# Altium schematic sheet BLOCK DIAGRAM.SchDoc
size A3; DocumentNumber: 2; SheetNumber: 2; SheetTotal: 6
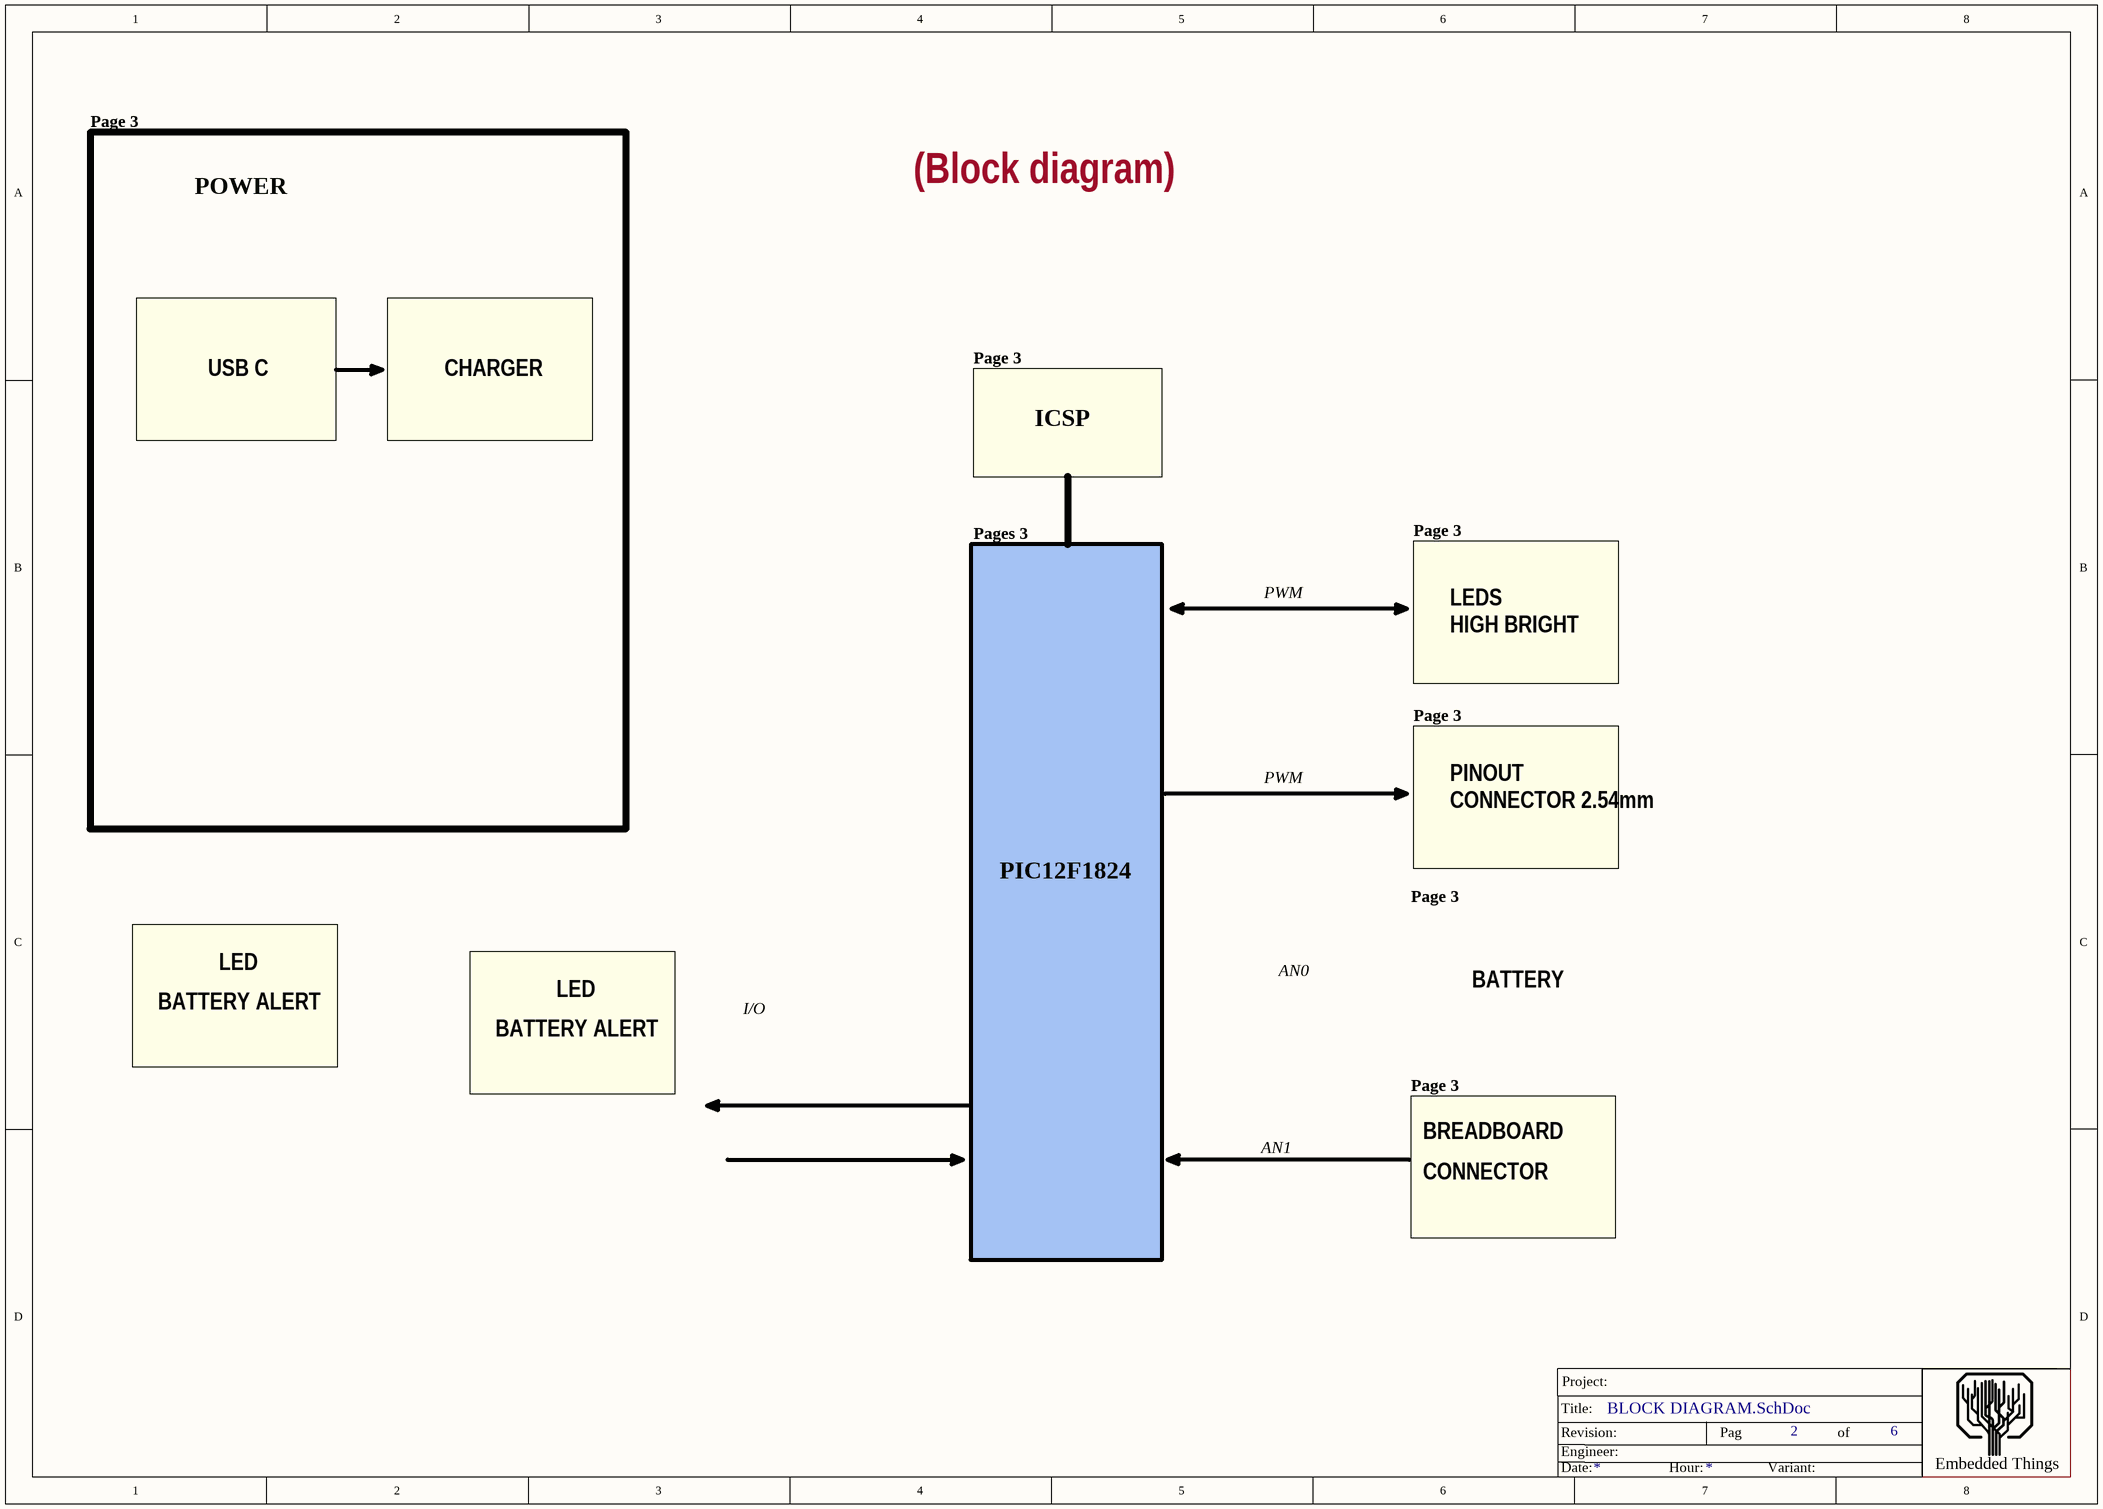
[diagram p0: BLOCK DIAGRAM.SchDoc]

## Notes on the sheet
- Page 3
- POWER
- (Block diagram)
- USB C
- CHARGER
- ICSP
- Pages 3
- PWM
- LEDS
- HIGH BRIGHT
- PINOUT
- CONNECTOR 2.54mm
- PIC12F1824
- LED
- AN0
- BATTERY
- BATTERY ALERT
- I/O
- AN1
- BREADBOARD
- CONNECTOR
- CLOCKS (CPU & PCIE)
- Project:
- Revision:
- Engineer:
- Title:
- Pag
- of
- Date:
- Hour:
- Variant:
- Embedded Things